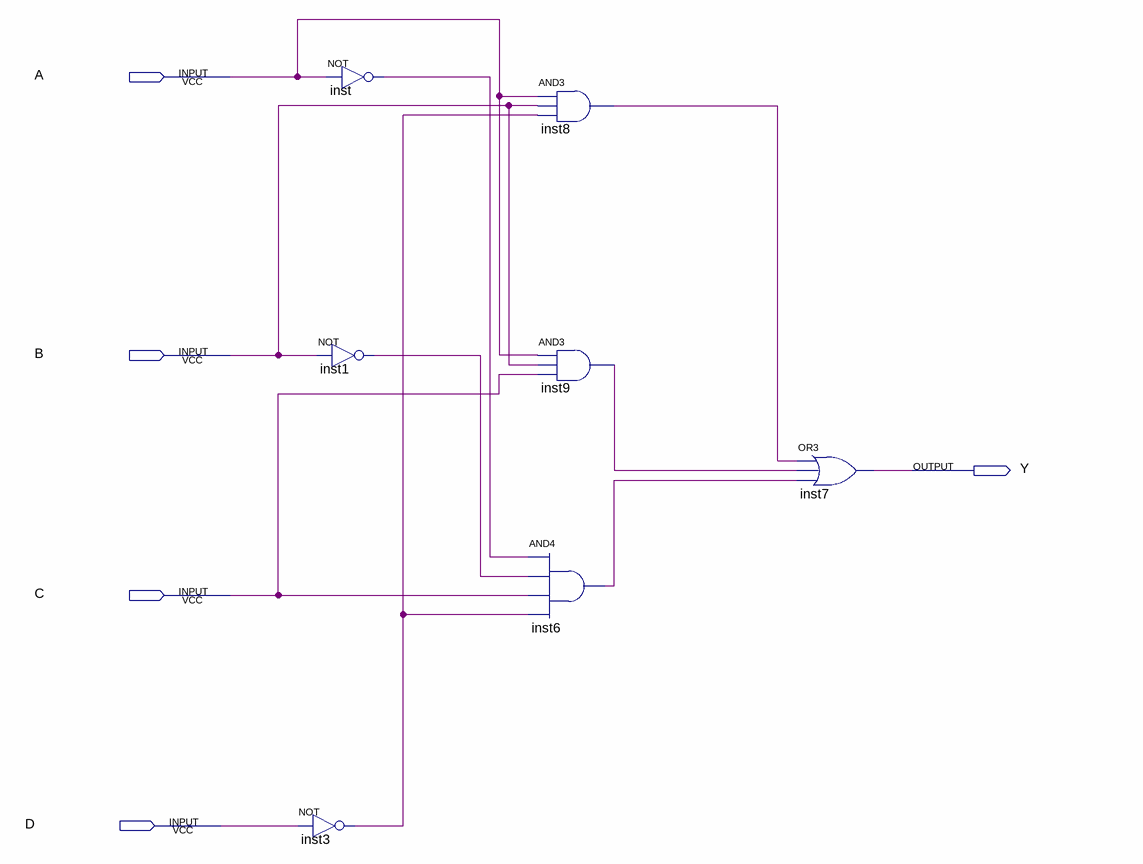
[diagram p0: schematic sheet]
// Quartus schematic segmentcircuit2.bdf as structural Verilog: 7 symbols, 5 pins
module segmentcircuit2 (
  input  A,
  input  B,
  input  C,
  input  D,
  output Y
);

  wire inst1_out, inst3_out, inst6_out, inst8_out, inst9_out, inst_out;

  not inst1 (inst1_out, B);
  not inst3 (inst3_out, D);
  not inst (inst_out, A);
  and inst8 (inst8_out, A, B, inst3_out);
  and inst9 (inst9_out, A, B, C);
  and inst6 (inst6_out, inst_out, inst1_out, C, inst3_out);
  or inst7 (Y, inst8_out, inst9_out, inst6_out);
endmodule
